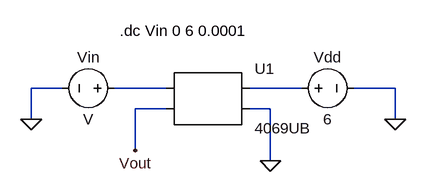
[diagram p0: schematic Q2.1.asc]
Q2.1.asc, the LTspice schematic file:
Version 4
SHEET 1 880 680
WIRE 176 256 128 256
WIRE 336 256 256 256
WIRE 544 256 464 256
WIRE 688 256 624 256
WIRE 336 288 288 288
WIRE 496 288 464 288
WIRE 128 304 128 256
WIRE 688 304 688 256
WIRE 288 352 288 288
WIRE 496 368 496 288
FLAG 688 304 0
FLAG 128 304 0
FLAG 496 368 0
FLAG 288 352 Vout
SYMBOL voltage 272 256 R90
WINDOW 0 -32 56 VBottom 2
WINDOW 3 32 56 VTop 2
SYMATTR InstName Vin
SYMBOL voltage 528 256 R270
WINDOW 0 32 56 VTop 2
WINDOW 3 -32 56 VBottom 2
SYMATTR InstName Vdd
SYMATTR Value 6
SYMBOL AutoGenerated/4069UB 400 272 R0
SYMATTR InstName U1
TEXT 264 168 Left 2 !.dc Vin 0 6 0.0001

The netlist it stands for:
* Q2.1.asc
Vin N001 0 V
Vdd N002 0 6
* U1: 4069UB (symbol AutoGenerated/4069UB not available, pins judged from their places): pin1=N001 pin2=Vout pin3=N002 pin4=0
.dc Vin 0 6 0.0001
.backanno
.end